# Altium schematic sheet 3PhaseMotorDriver.SchDoc
size B
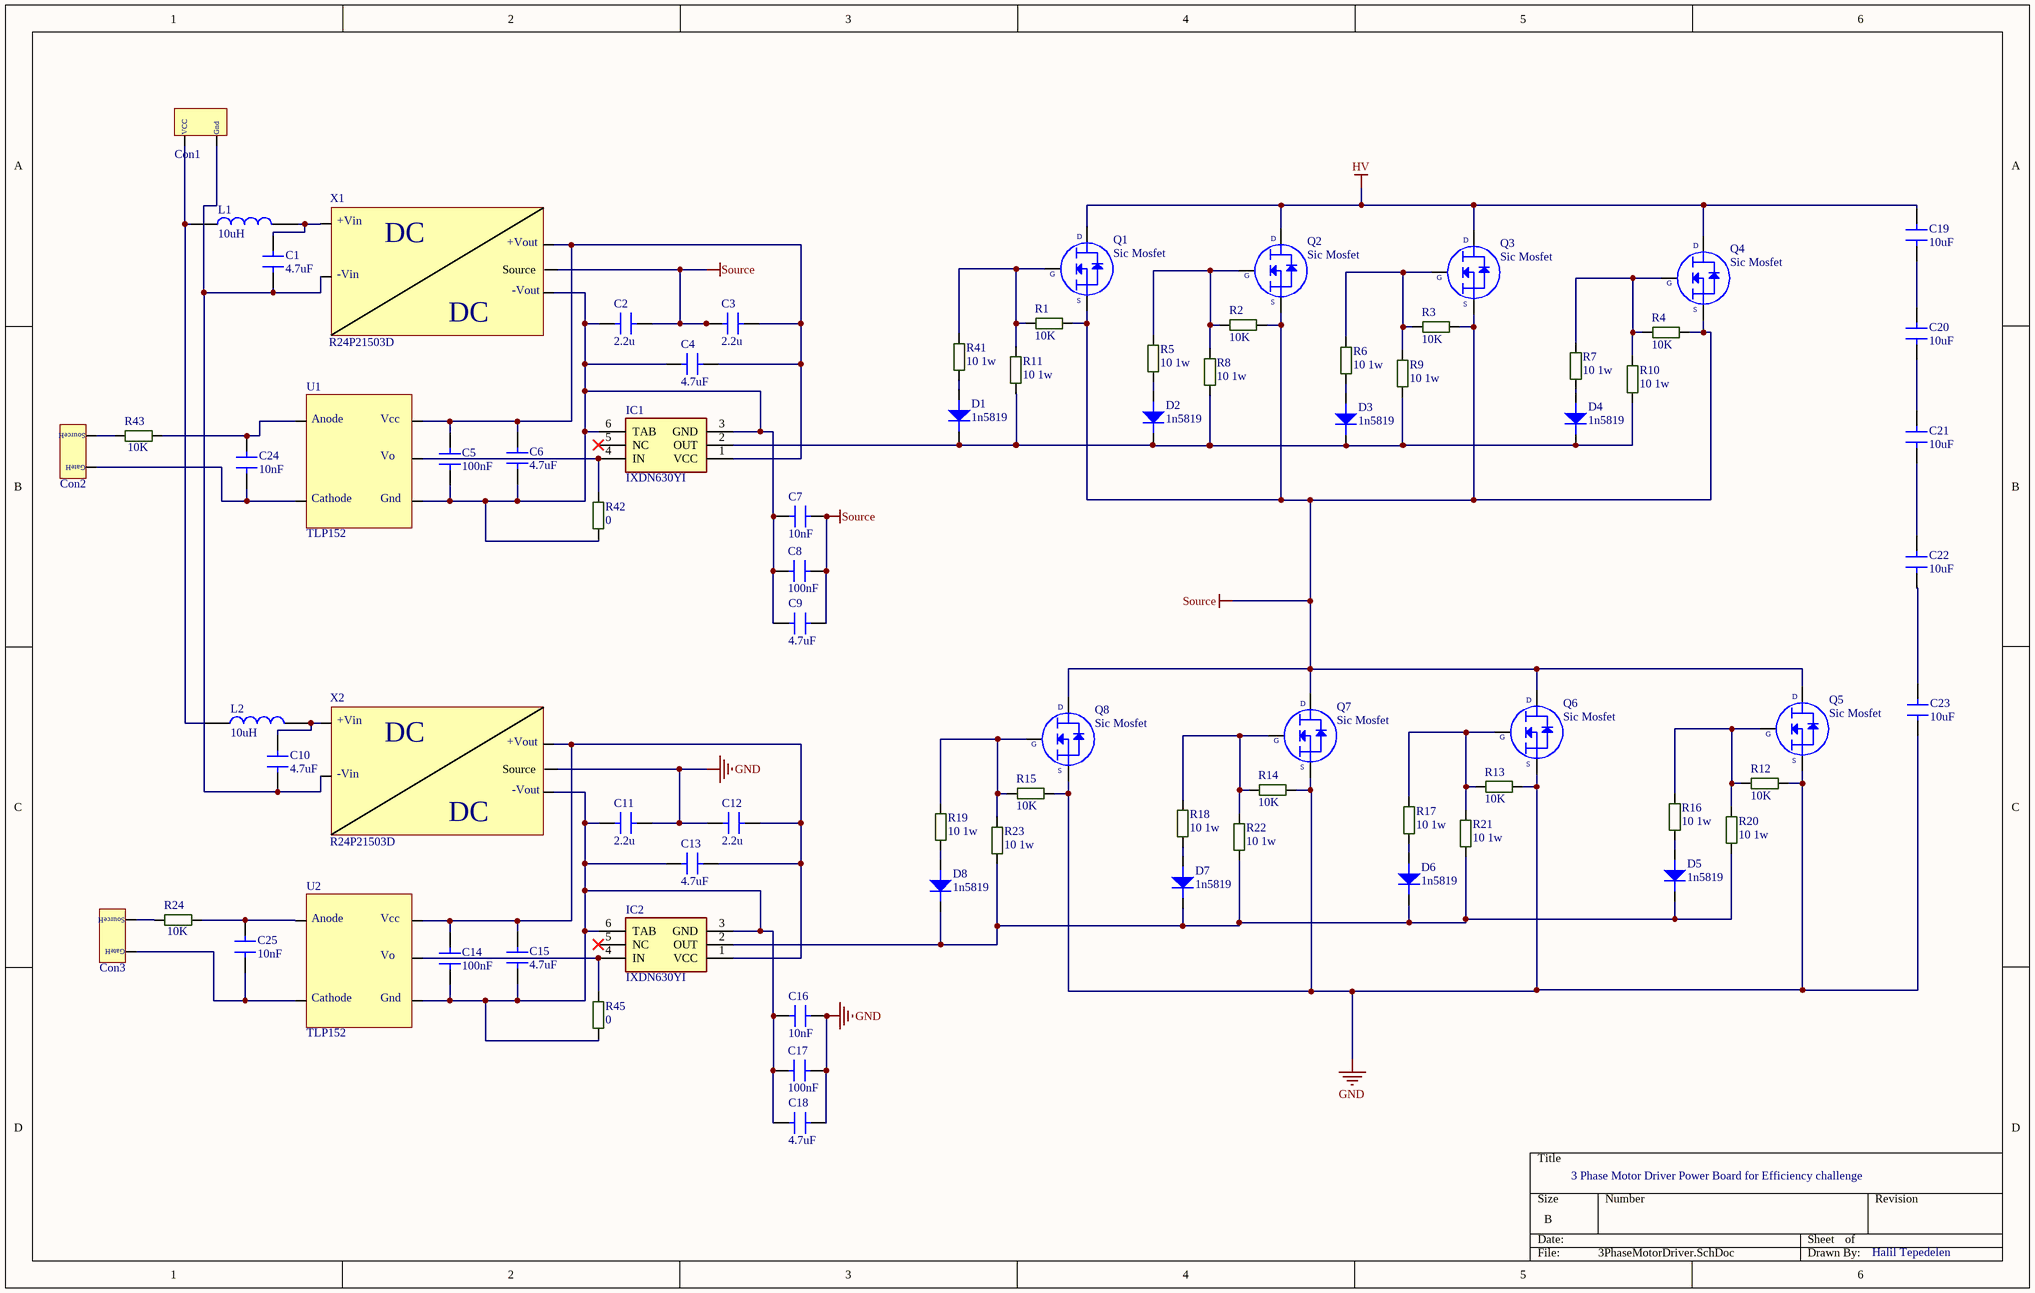
[diagram p0: 3PhaseMotorDriver.SchDoc]

## Parts
C1  4.7uF  [C-1206]
C2  2.2u  [C-0805]
C3  2.2u  [C-0805]
C4  4.7uF  [C-1206]
C5  100nF  [C-0805]
C6  4.7uF  [C-1206]
C7  10nF  [C-0805]
C8  100nF  [C-0805]
C9  4.7uF  [C-1206]
C10  4.7uF  [C-1206]
C11  2.2u  [C-0805]
C12  2.2u  [C-0805]
C13  4.7uF  [C-1206]
C14  100nF  [C-0805]
C15  4.7uF  [C-1206]
C16  10nF  [C-0805]
C17  100nF  [C-0805]
C18  4.7uF  [C-1206]
C19  10uF  [C-2220R]
C20  10uF  [C-2220R]
C21  10uF  [C-2220R]
C22  10uF  [C-2220R]
C23  10uF  [C-2220R]
C24  10nF  [C-0805]
C25  10nF  [C-0805]
Con1  Connector  [Conn]  (value not drawn)
Con2  Connector2_1  [Conn]  (value not drawn)
Con3  Connector2_1  [Conn]  (value not drawn)
D1  1n5819  [SOD123]
D2  1n5819  [SOD123]
D3  1n5819  [SOD123]
D4  1n5819  [SOD123]
D5  1n5819  [SOD123]
D6  1n5819  [SOD123]
D7  1n5819  [SOD123]
D8  1n5819  [SOD123]
IC1  IXDN630YI  [5-LEAD_TO-263]
IC2  IXDN630YI  [5-LEAD_TO-263]
L1  10uH  [WE-TPC_282892]
L2  10uH  [WE-TPC_282892]
Q1  Sic Mosfet  [247]
Q2  Sic Mosfet  [247]
Q3  Sic Mosfet  [247]
Q4  Sic Mosfet  [247]
Q5  Sic Mosfet  [247]
Q6  Sic Mosfet  [247]
Q7  Sic Mosfet  [247]
Q8  Sic Mosfet  [247]
R1  10K  [R-1206]
R2  10K  [R-1206]
R3  10K  [R-1206]
R4  10K  [R-1206]
R5  10 1w  [R-2512W]
R6  10 1w  [R-2512W]
R7  10 1w  [R-2512W]
R8  10 1w  [R-2512W]
R9  10 1w  [R-2512W]
R10  10 1w  [R-2512W]
R11  10 1w  [R-2512W]
R12  10K  [R-1206]
R13  10K  [R-1206]
R14  10K  [R-1206]
R15  10K  [R-1206]
R16  10 1w  [R-2512W]
R17  10 1w  [R-2512W]
R18  10 1w  [R-2512W]
R19  10 1w  [R-2512W]
R20  10 1w  [R-2512W]
R21  10 1w  [R-2512W]
R22  10 1w  [R-2512W]
R23  10 1w  [R-2512W]
R24  10K  [R-1206]
R41  10 1w  [R-2512W]
R42  0  [R-0805]
R43  10K  [R-1206]
R45  0  [R-0805]
U1  TLP152  [TLP152]
U2  TLP152  [TLP152]
X1  R24P21503D  [SIP7]
X2  R24P21503D  [SIP7]

## Nets
GND: C11.1 C12.2 C16.2 C17.2 C18.2 C23.1 Q5.3 Q6.3 Q7.3 Q8.3 R12.2 R13.2 R14.2 R15.2 X2.6(Source)
HV: C19.2 Q1.2 Q2.2 Q3.2 Q4.2
Source: C2.1 C3.2 C7.2 C8.2 C9.2 Q1.3 Q2.3 Q3.3 Q4.3 Q5.2 Q6.2 Q7.2 Q8.2 R1.2 R2.2 R3.2 R4.2 X1.6(Source)
NetC1_1: C1.1 C10.1 Con1.2 X1.2 X2.2
NetC1_2: C1.2 L1.2 X1.1
NetC2_2: C2.2 C4.1 C5.1 C6.1 C7.1 C8.1 C9.1 IC1.3(GND) IC1.6(TAB) R42.1 U1.3 X1.5
NetC3_1: C3.1 C4.2 C5.2 C6.2 IC1.1(VCC) U1.5 X1.7
NetC10_2: C10.2 L2.2 X2.1
NetC11_2: C11.2 C13.1 C14.1 C15.1 C16.1 C17.1 C18.1 IC2.3(GND) IC2.6(TAB) R45.1 U2.3 X2.5
NetC12_1: C12.1 C13.2 C14.2 C15.2 IC2.1(VCC) U2.5 X2.7
NetC19_1: C19.1 C20.2
NetC20_1: C20.1 C21.2
NetC21_1: C21.1 C22.2
NetC22_1: C22.1 C23.2
NetC24_1: C24.1 Con2.1 U1.2
NetC24_2: C24.2 R43.1 U1.1
NetC25_1: C25.1 Con3.1 U2.2
NetC25_2: C25.2 R24.1 U2.1
NetCon1_1: Con1.1 L1.1 L2.1
NetCon2_2: Con2.2 R43.2
NetCon3_2: Con3.2 R24.2
NetD1_a: D1.a R41.2
NetD1_k: D1.k D2.k D3.k D4.k IC1.2(OUT) R8.1 R9.1 R10.1 R11.1
NetD2_a: D2.a R5.2
NetD3_a: D3.a R6.2
NetD4_a: D4.a R7.2
NetD5_a: D5.a R16.2
NetD5_k: D5.k D6.k D7.k D8.k IC2.2(OUT) R20.1 R21.1 R22.1 R23.1
NetD6_a: D6.a R17.2
NetD7_a: D7.a R18.2
NetD8_a: D8.a R19.2
NetIC1_4: IC1.4(IN) R42.2 U1.4
NetIC2_4: IC2.4(IN) R45.2 U2.4
NetQ1_1: Q1.1 R1.1 R11.2 R41.1
NetQ2_1: Q2.1 R2.1 R5.1 R8.2
NetQ3_1: Q3.1 R3.1 R6.1 R9.2
NetQ4_1: Q4.1 R4.1 R7.1 R10.2
NetQ5_1: Q5.1 R12.1 R16.1 R20.2
NetQ6_1: Q6.1 R13.1 R17.1 R21.2
NetQ7_1: Q7.1 R14.1 R18.1 R22.2
NetQ8_1: Q8.1 R15.1 R19.1 R23.2

Not connected (* = marked no-connect by the designer): IC1 5(NC)*; IC2 5(NC)*

## Notes on the sheet
- 3 Phase Motor Driver Power Board for Efficiency challenge
- Halil Tepedelen
- (in symbol Connector) VCC; Gnd
- (in symbol Connector2_1) SourceH; GateH
- (in symbol R24P21503D) +Vin; DC; +Vout; -Vin; -Vout
- (in symbol Sic Mosfet To247) D; G; S
- (in symbol TLP152(TPL,E) Anode; Vcc; Vo; Cathode; Gnd

## Library data of the parts
C1 C4 C6 C9 C10 C13 C15 C18 = C-1206: MLCC (3216) 1206 4.7uF 50VDC ±10% X7R; Özdisan Part Number: CL31B475KBHNNNE; Manufacturer: SAMSUNG; Link: https://www.ozdisan.com/pasif-komponentler/kondansatorler/smd-kondansatorler-mlcc/CL31B475KBHNNNE; Price: 0,10407
C2 C3 C5 C7 C8 C11 C12 C14 C16 C17 C24 C25 = C-0805: MLCC (2012) 0805 2.2uF 50VDC ±10% X5R; Manufacturer: SAMSUNG; Özdisan Part Number: CL21A225KBQNNNE; Price: 0,04880; Link: https://www.ozdisan.com/pasif-komponentler/kondansatorler/smd-kondansatorler-mlcc/CL21A225KBQNNNE
C19-C23 = Cap2220: 2220; Özdisan Part Number: CL31B475KBHNNNE; Manufacturer: SAMSUNG; Link: https://www.ozdisan.com/pasif-komponentler/kondansatorler/smd-kondansatorler-mlcc/CL31B475KBHNNNE; Price: 0,10407
Con1 = Connector: PIN HEADER 40PIN(1x40) 2.54mm THT V/T; Özdisan Part Number: KLS1-207-1-40-S-3X9.5X15; Manufacturer: KLS ELECTRONIC; Link: https://www.ozdisan.com/konnektor-baglanti-elemanlari/headers/pin-header/KLS1-207-1-40-S-3X9-5X15; Price: 0,17227
Con2 Con3 = Connector2_1: PIN HEADER 40PIN(1x40) 2.54mm THT V/T; Özdisan Part Number: KLS1-207-1-40-S-3X9.5X15; Manufacturer: KLS ELECTRONIC; Price: 0,17227; Link: https://www.ozdisan.com/konnektor-baglanti-elemanlari/headers/pin-header/KLS1-207-1-40-S-3X9-5X15
D1-D8 = 1N4148W-E3-18: DIODE SCHOTTKY 1A 40V SOD123; Manufacturer: HOTTECH; Özdisan Part Number: B5819W; ComponentLink1URL: https://datasheet.ciiva.com/29885/1n4148w-29885941.pdf?src-supplier=Avnet; ComponentLink1Description: https://datasheet.ciiva.com/29885/1n4148w-29885941.pdf?src-supplier=Avnet; ComponentLink2URL: https://datasheet.ciiva.com/29593/1n4148w-29593113.pdf?src-supplier=Digi-Key; ComponentLink2Description: https://datasheet.ciiva.com/29593/1n4148w-29593113.pdf?src-supplier=Digi-Key; ComponentLink3URL: https://datasheet.ciiva.com/29593/1n4148w-29593111.pdf?src-supplier=Digi-Key; ComponentLink3Description: https://datasheet.ciiva.com/29593/1n4148w-29593111.pdf?src-supplier=Digi-Key; ComponentLink4URL: https://datasheet.ciiva.com/29593/1n4148w-29593112.pdf?src-supplier=Digi-Key; ComponentLink4Description: https://datasheet.ciiva.com/29593/1n4148w-29593112.pdf?src-supplier=Digi-Key; Link: https://www.ozdisan.com/guc-yari-iletkenleri/diyot-modul-diyot-dogrultucular/schottky-diyotlar/B5819W; Price: 0,04258
IC1 IC2 = IXDN630YI: Integrated Circuit; Manufacturer_Name: IXYS SEMICONDUCTOR; Datasheet Link: https://www.mouser.com/datasheet/2/240/IXD_630-1545995.pdf; Manufacturer_Part_Number: IXDN630YI; Mouser Part Number: 849-IXDN630YI; Mouser Price/Stock: https://www.mouser.co.uk/ProductDetail/IXYS-Integrated-Circuits/IXDN630YI?qs=uhAJVUz%252BE3%2FH75bq1SGVng%3D%3D; Arrow Part Number: IXDN630YI; Arrow Price/Stock: https://www.arrow.com/en/products/ixdn630yi/ixys
L1 L2 = inductor: INDUCTOR POWER 10UH 2.8X2.8X2.8MM SMD; Özdisan Part Number: 744025100; Manufacturer: WURTH; Link: https://www.ozdisan.com/pasif-komponentler/induktorler/sabit-induktor/744025100; Price: 0,74325
Q1-Q8 = Sic Mosfet To247
R1-R4 R12-R15 R24 R43 = R-1206_GS: 1206S4F1002T5E; ComponentLink1Description: link; ComponentLink1URL: https://www.ozdisan.com/pasif-komponentler/direncler/smt-smd-direncler/1206S4F1002T5E
R5-R11 R16-R23 R41 = R-2512
R42 R45 = Res0805: RES.(2012) 0805 0 Ohms 5% 1/8W-S 800PPM; Manufacturer: ROYALOHM; Özdisan Part Number: 0805S8J0000T5E; Link: https://www.ozdisan.com/pasif-komponentler/direncler/smt-smd-direncler/0805S8J0000T5E; Price: 0,00234
U1 U2 = TLP152(TPL,E: IC-152 PHOTOCOUPLER GATE DRIVE SO6 TOSHIBA; ComponentLink1URL: https://datasheet.ciiva.com/41848/tlp152-datasheet-en-20120914-41848928.pdf?src-supplier=Digi-Key; ComponentLink1Description: https://datasheet.ciiva.com/41848/tlp152-datasheet-en-20120914-41848928.pdf?src-supplier=Digi-Key; Price: 0,80155; Link: https://www.ozdisan.com/optolar-sensorler/optolar/gate-surucu-optokuplorleri/TLP152TPLE; Özdisan Part Number: TLP152(TPL,E; Manufacturer: TOSHIBA
X1 X2 = R24P21503D: Manufacturer: Recom; Max Output Voltage: 15V; Supplier 1: Digi-Key; Manufacturer Part Number: R24P21503D; RoHS: No; Stock 1: 378; Pricing 1: 1 = 8.78000, 5 = 8.71200, 10 = 8.64500, 25 = 8.51200, 50 = 8.24600, 100 = 7.44800, 250 = 7.31500, 500 = 7.18200 (USD); Weight: 4.3g; Length: 19.5mm; Height: 12.5mm; Width: 9.8mm; Supplier Part Number 1: 945-3071-5-ND